# EAGLE design io-joint (EAGLE 4.16)
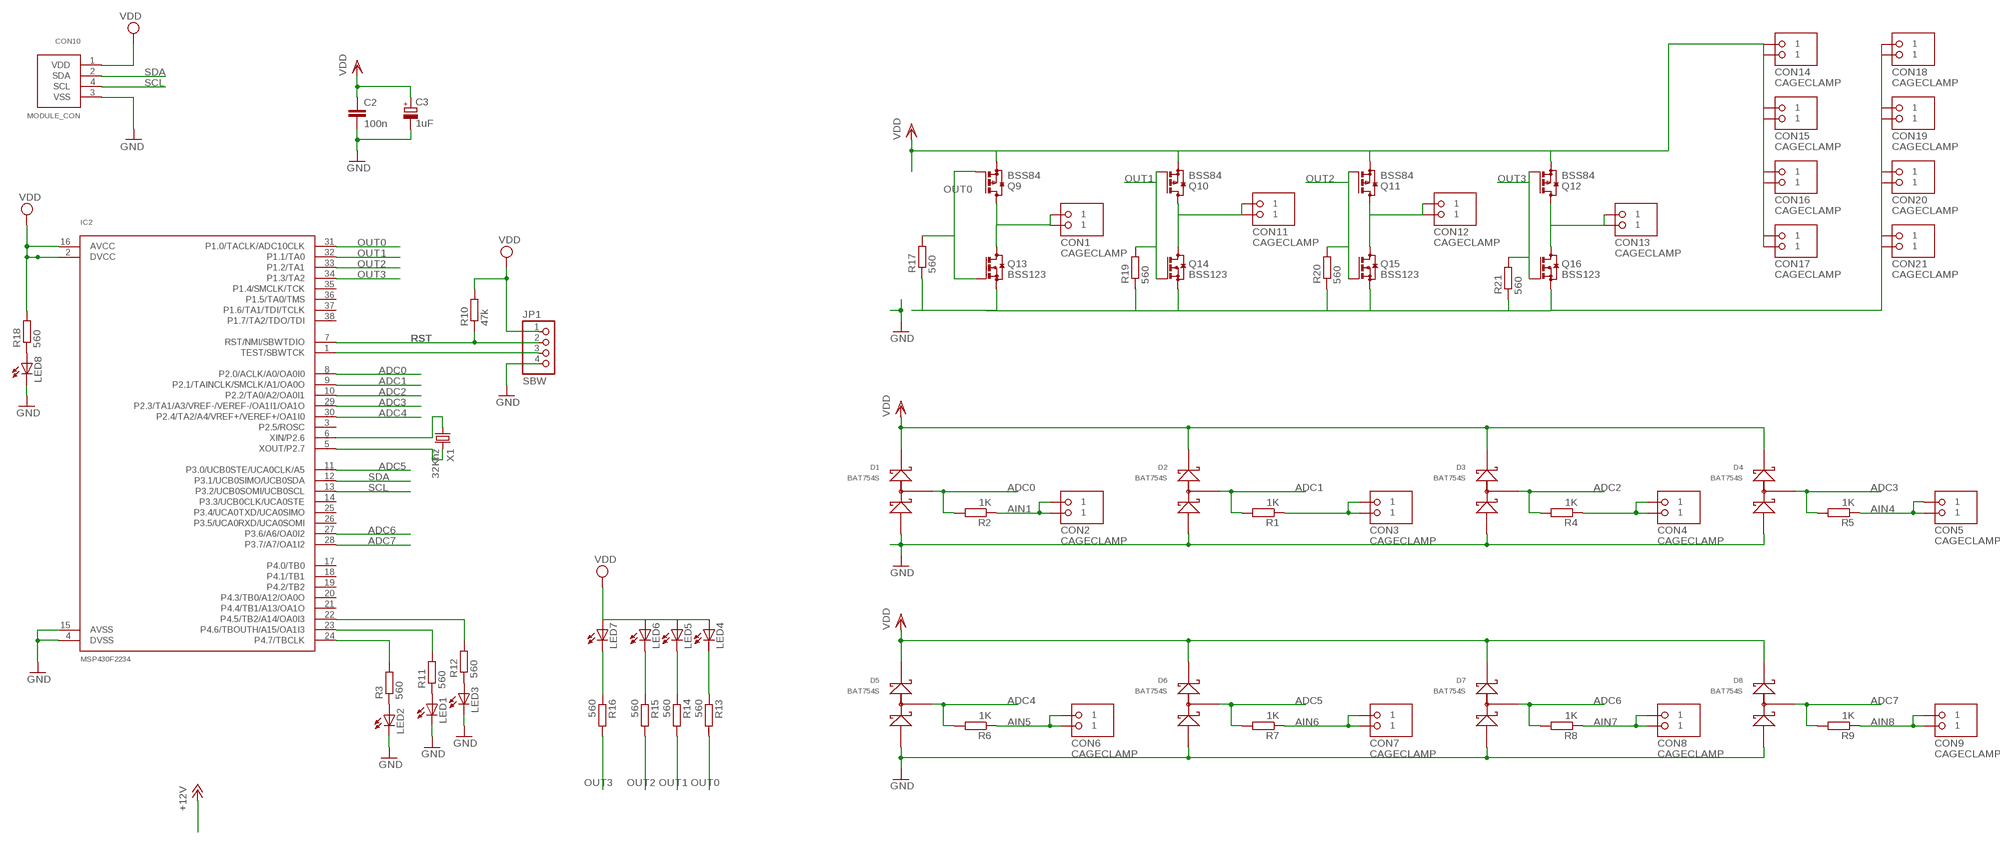
[diagram p0: schematic, sheet 1]

## Parts
C2  100n  C-EUC0603  [C0603]
C3  1uF  CPOL-EUB45181A  [B45181A]
CON1  CAGECLAMP  [CAGECLAMP]
CON2  CAGECLAMP  [CAGECLAMP]
CON3  CAGECLAMP  [CAGECLAMP]
CON4  CAGECLAMP  [CAGECLAMP]
CON5  CAGECLAMP  [CAGECLAMP]
CON6  CAGECLAMP  [CAGECLAMP]
CON7  CAGECLAMP  [CAGECLAMP]
CON8  CAGECLAMP  [CAGECLAMP]
CON9  CAGECLAMP  [CAGECLAMP]
CON10  MODULE_CON  [RJ11-4P4C]
CON11  CAGECLAMP  [CAGECLAMP]
CON12  CAGECLAMP  [CAGECLAMP]
CON13  CAGECLAMP  [CAGECLAMP]
CON14  CAGECLAMP  [CAGECLAMP]
CON15  CAGECLAMP  [CAGECLAMP]
CON16  CAGECLAMP  [CAGECLAMP]
CON17  CAGECLAMP  [CAGECLAMP]
CON18  CAGECLAMP  [CAGECLAMP]
CON19  CAGECLAMP  [CAGECLAMP]
CON20  CAGECLAMP  [CAGECLAMP]
CON21  CAGECLAMP  [CAGECLAMP]
D1  BAT754S  [SOT23]
D2  BAT754S  [SOT23]
D3  BAT754S  [SOT23]
D4  BAT754S  [SOT23]
D5  BAT754S  [SOT23]
D6  BAT754S  [SOT23]
D7  BAT754S  [SOT23]
D8  BAT754S  [SOT23]
IC2  MSP430F2234  [TSSOP38]
JP1  SBW  PINHD-1X4  [1X04]
LED1  LED3MM  [LED3MM]
LED2  LED3MM  [LED3MM]
LED3  LED3MM  [LED3MM]
LED4  LED3MM  [LED3MM]
LED5  LED3MM  [LED3MM]
LED6  LED3MM  [LED3MM]
LED7  LED3MM  [LED3MM]
LED8  LED3MM  [LED3MM]
Q9  BSS84  [SOT23]
Q10  BSS84  [SOT23]
Q11  BSS84  [SOT23]
Q12  BSS84  [SOT23]
Q13  BSS123  [SOT23]
Q14  BSS123  [SOT23]
Q15  BSS123  [SOT23]
Q16  BSS123  [SOT23]
R1  1K  R-EU_M1206  [M1206]
R2  1K  R-EU_M1206  [M1206]
R3  560  R-EU_M1206  [M1206]
R4  1K  R-EU_M1206  [M1206]
R5  1K  R-EU_M1206  [M1206]
R6  1K  R-EU_M1206  [M1206]
R7  1K  R-EU_M1206  [M1206]
R8  1K  R-EU_M1206  [M1206]
R9  1K  R-EU_M1206  [M1206]
R10  47k  R-EU_M1206  [M1206]
R11  560  R-EU_M1206  [M1206]
R12  560  R-EU_M1206  [M1206]
R13  560  R-EU_M1206  [M1206]
R14  560  R-EU_M1206  [M1206]
R15  560  R-EU_M1206  [M1206]
R16  560  R-EU_M1206  [M1206]
R17  560  R-EU_M1206  [M1206]
R18  560  R-EU_M1206  [M1206]
R19  560  R-EU_M1206  [M1206]
R20  560  R-EU_M1206  [M1206]
R21  560  R-EU_M1206  [M1206]
X1  32Khz  CRYSTALTC26H  [TC26H]

## Nets
ADC0: D1.3(MID) IC2.8(P2.0/ACLK/A0/OA0I0) R2.2
ADC1: D2.3(MID) IC2.9(P2.1/TAINCLK/SMCLK/A1/OA0O) R1.2
ADC2: D3.3(MID) IC2.10(P2.2/TA0/A2/OA0I1) R4.2
ADC3: D4.3(MID) IC2.29(P2.3/TA1/A3/VREF-/VEREF-/OA1I1/OA1O) R5.2
ADC4: D5.3(MID) IC2.30(P2.4/TA2/A4/VREF+/VEREF+/OA1I0) R6.2
ADC5: D6.3(MID) IC2.11(P3.0/UCB0STE/UCA0CLK/A5) R7.2
ADC6: D7.3(MID) IC2.27(P3.6/A6/OA0I2) R8.2
ADC7: D8.3(MID) IC2.28(P3.7/A7/OA1I2) R9.2
AIN1: CON2.1 CON2.2 R2.1
AIN4: CON5.1 CON5.2 R5.1
AIN5: CON6.1 CON6.2 R6.1
AIN6: CON7.1 CON7.2 R7.1
AIN7: CON8.1 CON8.2 R8.1
AIN8: CON9.1 CON9.2 R9.1
GND: C2.2 C3.- CON10.3(VSS) CON18.1 CON18.2 CON19.1 CON19.2 CON20.1 CON20.2 CON21.1 CON21.2 D1.1(ANODE) D2.1(ANODE) D3.1(ANODE) D4.1(ANODE) D5.1(ANODE) D6.1(ANODE) D7.1(ANODE) D8.1(ANODE) IC2.4(DVSS) IC2.15(AVSS) JP1.4 LED1.K(C) LED2.K(C) LED3.K(C) LED8.K(C) Q13.2(S) Q14.2(S) Q15.2(S) Q16.2(S) R17.1 R19.1 R20.1 R21.1
N$1: CON3.1 CON3.2 R1.1
N$2: CON11.1 CON11.2 Q10.3(D) Q14.3(D)
N$3: CON4.1 CON4.2 R4.1
N$4: IC2.6(XIN/P2.6) X1.1
N$5: IC2.24(P4.7/TBCLK) R3.2
N$6: LED2.A R3.1
N$7: CON1.1 CON1.2 Q9.3(D) Q13.3(D)
N$8: IC2.23(P4.6/TBOUTH/A15/OA1I3) R11.2
N$9: CON12.1 CON12.2 Q11.3(D) Q15.3(D)
N$10: IC2.1(TEST/SBWTCK) JP1.3
N$11: LED1.A R11.1
N$12: CON13.1 CON13.2 Q12.3(D) Q16.3(D)
N$13: IC2.22(P4.5/TB2/A14/OA0I3) R12.2
N$14: LED3.A R12.1
N$15: LED7.K(C) R16.1
N$16: LED6.K(C) R15.1
N$17: LED5.K(C) R14.1
N$18: LED4.K(C) R13.1
N$19: IC2.5(XOUT/P2.7) X1.2
N$20: LED8.A R18.1
OUT0: IC2.31(P1.0/TACLK/ADC10CLK) Q9.1(G) Q13.1(G) R13.2 R17.2
OUT1: IC2.32(P1.1/TA0) Q10.1(G) Q14.1(G) R14.2 R19.2
OUT2: IC2.33(P1.2/TA1) Q11.1(G) Q15.1(G) R15.2 R20.2
OUT3: IC2.34(P1.3/TA2) Q12.1(G) Q16.1(G) R16.2 R21.2
RST: IC2.7(RST/NMI/SBWTDIO) JP1.2 R10.1
SCL: CON10.4(SCL) IC2.13(P3.2/UCB0SOMI/UCB0SCL)
SDA: CON10.2(SDA) IC2.12(P3.1/UCB0SIMO/UCB0SDA)
VDD: C2.1 C3.+ CON10.1(VDD) CON14.1 CON14.2 CON15.1 CON15.2 CON16.1 CON16.2 CON17.1 CON17.2 D1.2(CATHODE) D2.2(CATHODE) D3.2(CATHODE) D4.2(CATHODE) D5.2(CATHODE) D6.2(CATHODE) D7.2(CATHODE) D8.2(CATHODE) IC2.2(DVCC) IC2.16(AVCC) JP1.1 LED4.A LED5.A LED6.A LED7.A Q9.2(S) Q10.2(S) Q11.2(S) Q12.2(S) R10.2 R18.2
Unconnected: IC2.3(P2.5/ROSC) IC2.14(P3.3/UCB0CLK/UCA0STE) IC2.17(P4.0/TB0) IC2.18(P4.1/TB1) IC2.19(P4.2/TB2) IC2.20(P4.3/TB0/A12/OA0O) IC2.21(P4.4/TB1/A13/OA1O) IC2.25(P3.4/UCA0TXD/UCA0SIMO) IC2.26(P3.5/UCA0RXD/UCA0SOMI) IC2.35(P1.4/SMCLK/TCK) IC2.36(P1.5/TA0/TMS) IC2.37(P1.6/TA1/TDI/TCLK) IC2.38(P1.7/TA2/TDO/TDI)

## Library data of the parts
C2 = rcl:C-EU: CAPACITOR, European symbol
C3 = rcl:CPOL-EU: POLARIZED CAPACITOR, European symbol
CON1-CON9 CON11-CON21 = ecssr:CAGECLAMP
CON10 = ecssr:MODULE_CON
D1-D8 = ecssr:BAT754S
IC2 = ecssr:MSP430F2234
JP1 = pinhead:PINHD-1X4: PIN HEADER
LED1-LED8 = led:LED: LED OSRAM: - CHIPLED LG R971, LG N971, LY N971, LG Q971, LY Q971, LO R971, LY R971 LH N974, LH R974 LS Q976, LO Q976, LY Q976 LO Q996 - Hyper CHIPLED LW Q18S LB Q993, LB Q99A, LB R99A - SideLED LS A670, LO A670, LY A670, LG A670, LP A670 LB A673, LV A673, LT A673, LW A673 LH A674 LY A675 LS A676, LA A676, LO A676, LY A676, LW A676 LS A679, LY A679, LG A679 - Hyper Micro SIDELED® LS Y876, LA Y876, LO Y876, LY Y876 LT Y87S - SmartLED LW L88C, LW L88S LB L89C, LB L89S, LG L890 LS L89K, LO L89K, LY L89K LS L896, LA L896, LO L896, LY L896 - TOPLED LS T670, LO T670, LY T670, LG T670, LP T670 LSG T670, LSP T670, LSY T670, LOP T670, LYG T670 LG T671, LOG T671, LSG T671 LB T673, LV T673, LT T673, LW T673 LH T674 LS T676, LA T676, LO T676, LY T676, LB T676, LH T676, LSB T676, LW T676 LB T67C, LV T67C, LT T67C, LS T67K, LO T67K, LY T67K, LW E67C LS E67B, LA E67B, LO E67B, LY E67B, LB E67C, LV E67C, LT E67C LW T67C LS T679, LY T679, LG T679 LS T770, LO T770, LY T770, LG T770, LP T770 LB T773, LV T773, LT T773, LW T773 LH T774 LS E675, LA E675, LY E675, LS T675 LS T776, LA T776, LO T776, LY T776, LB T776 LHGB T686 LT T68C, LB T68C - Hyper Mini TOPLED® LB M676 - Mini TOPLED Santana® LG M470 LS M47K, LO M47K, LY M47K Source: http://www.osram.convergy.de - LUMILED® LXK2-PW12-R00, LXK2-PW12-S00, LXK2-PW14-U00, LXK2-PW14-V00 LXK2-PM12-R00, LXK2-PM12-S00, LXK2-PM14-U00 LXK2-PE12-Q00, LXK2-PE12-R00, LXK2-PE12-S00, LXK2-PE14-T00, LXK2-PE14-U00 LXK2-PB12-K00, LXK2-PB12-L00, LXK2-PB12-M00, LXK2-PB14-N00, LXK2-PB14-P00, LXK2-PB14-Q00 LXK2-PR12-L00, LXK2-PR12-M00, LXK2-PR14-Q00, LXK2-PR14-R00 LXK2-PD12-Q00, LXK2-PD12-R00, LXK2-PD12-S00 LXK2-PH12-R00, LXK2-PH12-S00 LXK2-PL12-P00, LXK2-PL12-Q00, LXK2-PL12-R00 Source: www.luxeon.com
Q9-Q12 = transistor-small-signal:BSS84: P-CHANNEL MOS FET
Q13-Q16 = transistor-small-signal:BSS123: N-CHANNEL MOS FET
R1-R21 = rcl:R-EU_: RESISTOR, European symbol
X1 = crystal:CRYSTAL: CRYSTAL

## Board
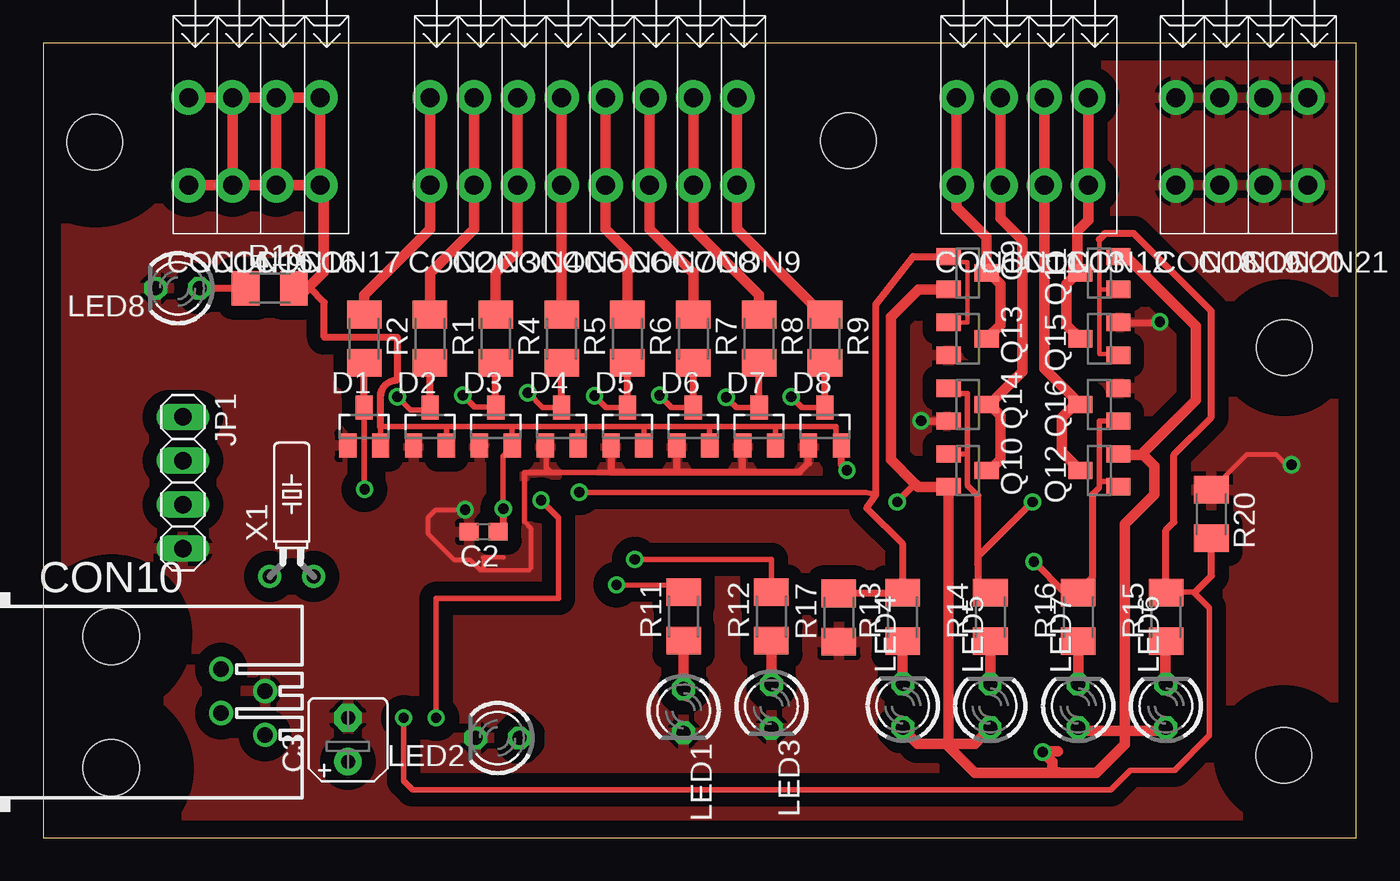
[diagram p1: board, top side]
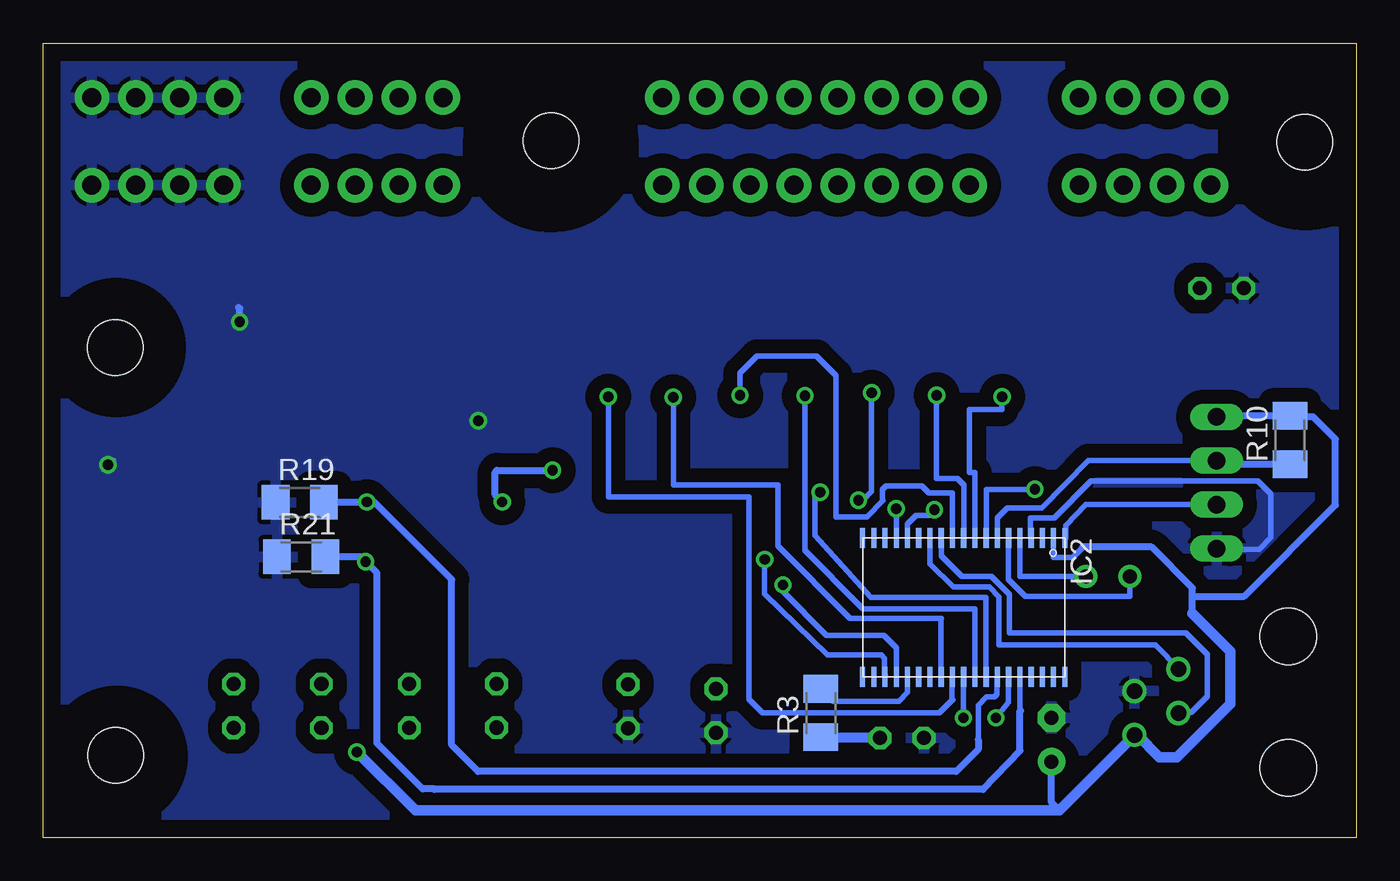
[diagram p2: board, bottom side, seen from below]

Size 76 x 46 mm. Coordinates in mm from the lower left corner, seen from the top.
Outline: 0,0 76,0 76,46 0,46 0,0
Copper layers (1*16): Top 0.035mm / dielectric 1.5mm / Bottom 0.035mm
Design rules "default": minimum track width 0.2mm, minimum drill 0.6mm, track to track 0.2mm, track to pad 0.2mm, pad to pad 0.2mm, via to via 0.2mm, smd to smd 0mil, copper to edge 40mil, drill to drill 8mil, minimum pad ring 10mil, minimum via ring 8mil, stop-mask expansion 4mil, vias tented up to drill 0mil, thermal gap 10mil
Holes 3.2 mm at 71.84,28.38 71.79,4.78 2.98,40.27 46.62,40.37
tRestrict: area -1,36.3 to 7,44.3; area 42.7,36.2 to 50.7,44.2; area 68.8,25.4 to 74.9,31.4; area 68.7,1.7 to 74.9,7.9; area 0.2,8 to 7.7,15.5; area 0.1,0.2 to 7.8,7.8
bRestrict: area -1.2,36.1 to 7.1,44.4; area 42.5,36 to 50.7,44.3; area 68.7,25.3 to 74.9,31.5; area 68.6,1.6 to 74.9,7.9

### Footprints (pad centres in the part's own frame; a part is rotated, then mirrored left to right if it is on the bottom)
C0603 = smd 1.1 x 1: 1 -0.85,0; 2 0.85,0
B45181A = drill 0.813 pad 1.6 round: + -1.27,0 | drill 0.813 pad 1.6 octagon: - 1.27,0
CAGECLAMP = drill 1.1 pad 2 round: 1 0,-0.01; 2 0,-5.08
RJ11-4P4C = drill 0.889 round: 1 1.905,8.89; 2 0.635,6.35; 3 -0.635,8.89; 4 -1.905,6.35 | hole 3.251: -3.81,0; 3.81,0
SOT23 = smd 1 x 1.4: 1 -0.95,-1.1; 2 0.95,-1.1; 3 0,1.1
TSSOP38 = smd 1.15 x 0.3: 1 0,0; 2 0,-0.65; 3 0,-1.3; 4 0,-1.95; 5 0,-2.6; 6 0,-3.25; 7 0,-3.9; 8 0,-4.55; 9 0,-5.2; 10 0,-5.85; 11 0,-6.5; 12 0,-7.15; 13 0,-7.8; 14 0,-8.45; 15 0,-9.1; 16 0,-9.75; 17 0,-10.4; 18 0,-11.05; 19 0,-11.7; 20 8.05,-11.7; 21 8.05,-11.05; 22 8.05,-10.4; 23 8.05,-9.75; 24 8.05,-9.1; 25 8.05,-8.45; 26 8.05,-7.8; 27 8.05,-7.15; 28 8.05,-6.5; 29 8.05,-5.85; 30 8.05,-5.2; 31 8.05,-4.55; 32 8.05,-3.9; 33 8.05,-3.25; 34 8.05,-2.6; 35 8.05,-1.95; 36 8.05,-1.3; 37 8.05,-0.65; 38 8.05,0
1X04 = drill 1.016 long: 1 -3.81,0; 2 -1.27,0; 3 1.27,0; 4 3.81,0
LED3MM = drill 0.813 octagon: A -1.27,0; K 1.27,0
M1206 = smd 1.6 x 2: 1 -1.4,0; 2 1.4,0
TC26H = drill 0.813 round: 1 -1.27,0; 2 1.27,0

### Placement (x,y rotation side)
C2  25.49,17.71 180 top
C3  17.64,5.67 90 top
CON1  52.87,42.86 0 top
CON2  22.39,42.86 0 top
CON3  24.93,42.86 0 top
CON4  27.47,42.86 0 top
CON5  30.01,42.86 0 top
CON6  32.55,42.86 0 top
CON7  35.09,42.86 0 top
CON8  37.63,42.86 0 top
CON9  40.17,42.86 0 top
CON10  3.95,7.86 270 top
CON11  55.41,42.86 0 top
CON12  60.49,42.86 0 top
CON13  57.95,42.86 0 top
CON14  8.42,42.86 0 top
CON15  10.96,42.86 0 top
CON16  13.5,42.86 0 top
CON17  16.04,42.86 0 top
CON18  65.57,42.86 0 top
CON19  68.11,42.86 0 top
CON20  70.65,42.86 0 top
CON21  73.19,42.86 0 top
D1  18.58,23.81 0 top
D2  22.39,23.81 0 top
D3  26.2,23.81 0 top
D4  30.01,23.81 0 top
D5  33.82,23.81 0 top
D6  37.63,23.81 0 top
D7  41.44,23.81 0 top
D8  45.25,23.81 0 top
IC2  16.88,17.36 270 bottom
JP1  8.09,20.56 270 top
LED1  37.07,7.35 270 top
LED2  26.3,5.78 180 top
LED3  42.15,7.6 270 top
LED4  49.75,7.65 90 top
LED5  54.81,7.63 90 top
LED6  64.98,7.63 90 top
LED7  59.9,7.63 90 top
LED8  7.78,31.81 180 top
Q9  53.5,32.7 270 top
Q10  53.5,21.27 270 top
Q11  61.12,32.7 90 top
Q12  61.12,21.27 90 top
Q13  53.5,28.89 270 top
Q14  53.5,25.08 270 top
Q15  61.12,28.89 90 top
Q16  61.12,25.08 90 top
R1  22.39,28.89 270 top
R2  18.58,28.89 270 top
R3  31,7.22 90 bottom
R4  26.2,28.89 270 top
R5  30.01,28.89 270 top
R6  33.82,28.89 270 top
R7  37.63,28.89 270 top
R8  41.44,28.89 270 top
R9  45.25,28.89 270 top
R10  3.84,23.02 90 bottom
R11  37.07,12.81 90 top
R12  42.15,12.81 90 top
R13  49.74,12.79 90 top
R14  54.82,12.79 90 top
R15  64.98,12.79 90 top
R16  59.9,12.79 90 top
R17  46.05,12.75 90 top
R18  13.12,31.81 0 top
R19  61.15,19.42 0 bottom
R20  67.61,18.74 270 top
R21  61.07,16.27 0 bottom
X1  14.39,15.12 0 top

### Tracks (layer width: path | path; a pad name or v marks a point on that pad's centre or on a via)
ADC0  (via drill 0.6)
  Top 0.305: D1.3 18.58,20.2 v18.6,20.18
  Top 0.406: 18.6,27.49 | 18.6,27.49 R2.2 | D1.3 18.58,27.47 18.6,27.49
  Bottom 0.305: IC2.8 21.4,17.36 21.4,20.18 v18.6,20.18
ADC1  (via drill 0.6)
  Top 0.305: D2.3 22.36,24.88 22.36,24.77 21.27,24.77 v20.51,25.54
  Top 0.406: R1.2 22.39,27.44 22.41,27.42 22.39,27.39 D2.3
  Bottom 0.305: IC2.9 22.08,17.36 22.08,21.14 22.39,21.14 22.39,24.8 20.51,24.8 v20.51,25.54
ADC2  (via drill 0.6)
  Top 0.305: 26.21,24.93 26.22,24.93 | 26.21,24.93 D3.3 | v24.29,25.61 24.98,24.93 26.21,24.93
  Top 0.406: D3.3 26.2,25.13 26.22,25.16 26.2,25.18 R4.2
  Bottom 0.305: IC2.10 22.73,20.43 23.09,20.8 24.29,20.8 v24.29,25.61
ADC3  (via drill 0.6)
  Top 0.305: D4.3 28.91,24.91 v28.05,25.77 | v28.81,19.54 29.83,18.53 29.83,13.85 22.74,13.85 v22.74,6.94
  Top 0.406: R5.2 30.01,27.44 29.96,27.39 30.01,27.34 D4.3
  Bottom 0.305: v28.05,25.77 28.05,20.05 28.56,19.54 v28.81,19.54 | 22.73,9.36 22.72,9.36 | 22.73,9.36 IC2.29 22.73,9.26 22.74,9.26 v22.74,6.94 | 22.73,9.36 22.74,9.36
ADC4  (via drill 0.6)
  Top 0.305: D5.3 32.59,24.91 v31.91,25.59
  Top 0.406: 33.74,27.49 | 33.74,27.49 R6.2 | D5.3 33.82,27.42 33.74,27.49
  Bottom 0.305: 22.07,9.33 22.06,9.33 | 22.07,9.33 IC2.30 22.07,9.36 | 22.07,9.33 22.08,9.33 | 22.07,9.36 22.06,9.36 | 22.07,9.36 22.08,9.36 22.08,13.26 28.56,13.26 28.73,13.43 28.72,13.43 31.92,16.63 31.92,16.98 v31.91,25.59
ADC5  (via drill 0.6)
  Top 0.305: D6.3 36.37,24.91 v35.67,25.61
  Top 0.406: 37.63,27.59 R7.2 D6.3
  Bottom 0.305: v35.67,25.61 35.67,26.91 34.68,27.9 31.25,27.9 30.11,26.76 30.11,18.58 28.33,18.58 27.39,19.52 27.39,19.54 27.42,19.57 27.42,20.18 27.24,20.36 25.13,20.36 24.75,19.97 23.38,19.97 IC2.11
ADC6  (via drill 0.6)
  Top 0.305: D7.3 40.13,24.91 v39.53,25.51
  Top 0.406: 41.44,27.52 R8.2 D7.3
  Bottom 0.305: v39.53,25.51 39.53,20.43 33.49,20.43 33.49,16.93 33.48,16.92 33.48,16.89 29.3,12.71 24.01,12.71 24.04,12.68 24.04,9.32 IC2.27
ADC7  (via drill 0.6)
  Top 0.305: D8.3 43.92,24.91 v43.29,25.54
  Top 0.406: D8.3 R9.2
  Bottom 0.305: v43.29,25.54 43.29,19.72 35.14,19.72 35.14,18.5 35.16,17.56 35.16,8.01 34.38,7.22 24.14,7.22 23.38,7.99 | IC2.28 23.38,9.28 23.4,9.28 23.4,8.01 23.38,7.99 | 23.38,7.99 23.35,7.99
AIN1
  Top 0.61: CON2.1 CON2.2 22.39,35.24 18.58,31.43 R2.1 18.58,30.16
AIN4
  Top 0.61: CON5.1 CON5.2 R5.1 30.01,30.16
AIN5
  Top 0.61: CON6.1 CON6.2 32.55,35.24 33.82,33.97 R6.1 33.82,30.16
AIN6
  Top 0.61: 37.63,30.16 R7.1 37.63,32.7 35.09,35.24 CON7.2 35.09,42.88 | 35.09,42.88 CON7.1 | 35.09,42.88 35.06,42.91
AIN7
  Top 0.61: CON8.1 CON8.2 37.63,35.24 41.44,31.43 R8.1 41.44,30.16
AIN8
  Top 0.61: CON9.1 CON9.2 40.17,35.24 45.25,30.16 R9.1
GND  (via drill 0.6)
  Top 0.254: 26.64,16.24 25.47,16.24 25.48,16.23 25.48,15.66 25.31,15.49 | 27.85,18.32 28.25,17.92 28.25,15.61 28.13,15.49 25.31,15.49 | 25.31,15.49 24.71,16.09 23.77,16.09 22.27,17.59 22.27,18.55 22.71,18.99 v24.42,18.99 v24.42,18.98 | R20.1 69.65,22.18 71.36,22.18 71.95,21.59 v72.26,21.59
  Top 0.305: D5.1 32.87,21.14 29.37,21.14 | D4.1 29.09,22.72 29.09,21.42 29.37,21.14 | 29.37,21.14 27.85,21.14 27.85,18.32 | 25.26,22.74 D3.1 25.25,22.69 25.24,22.68 25.52,22.4
  Top 0.406: Q15.2 64.59,29.84 v64.63,29.88 | Q14.2 v50.82,24.13 v50.81,24.14 | D8.1 44.3,21.69 43.77,21.17 40.5,21.17 | 36.71,21.17 32.85,21.17 32.87,21.18 D5.1 | 36.71,21.17 40.5,21.17 | D7.1 40.49,21.18 40.5,21.17 | D6.1 36.68,21.2 36.71,21.17
  Bottom 0.254: v72.26,21.59 71.97,21.88 71.89,21.88
  Bottom 0.305: IC2.4 18.86,17.39 18.86,18.53 17.48,18.53 15.35,20.66 5.7,20.66 4.94,19.9 4.94,17.38 5.62,16.7 8.01,16.7 8.06,16.75 JP1.4 | IC2.15 25.98,18.16 25.49,18.65 24.75,18.65 v24.42,18.98
  Bottom 0.406: v64.63,29.88 64.63,30.64 64.7,30.72 | v50.81,24.14 50.81,24.22 50.84,24.24
  pour Top (isolate 0.813): -3,48 -3,-2 77,-2 77,48
  pour Bottom (isolate 0.813): -2,50 -2,-1 79,-1 79,50
N$1
  Top 0.61: CON3.1 CON3.2 24.93,35.24 22.39,32.7 R1.1 22.39,30.16
N$2
  Top 0.61: 54.77,25.08 55.41,24.44 55.41,21.9 54.77,21.27 Q10.3 | 54.77,25.08 Q14.3 | 54.77,25.08 56.68,26.98 56.68,34.6 55.41,35.87 CON11.2 CON11.1
N$3
  Top 0.61: CON4.1 CON4.2 27.47,33.97 26.2,32.7 R4.1 26.2,30.16
N$4
  Bottom 0.305: X1.1 13.12,13.98 19.16,13.98 20.13,14.95 IC2.6
N$5
  Bottom 0.305: R3.2 30.28,7.91 26.48,7.91 25.97,8.42 25.97,9.3 IC2.24
N$6
  Bottom 0.61: LED2.A R3.1
N$7
  Top 0.61: Q13.3 55.41,29.69 55.41,32.06 54.77,32.7 Q9.3 54.6,34.77 52.87,36.51 CON1.2 CON1.1
N$8  (via drill 0.6)
  Top 0.305: R11.2 37.07,14.61 v33.18,14.64
  Bottom 0.305: v33.18,14.64 33.21,14.28 30.67,11.72 27.34,11.72 26.6,10.98 26.6,9.31 26.61,9.31 IC2.23
N$9
  Top 0.61: Q15.3 59.22,29.69 59.22,32.06 59.85,32.7 | 59.85,32.7 Q11.3 | 59.85,32.7 59.85,35.11 60.49,35.75 CON12.2 CON12.1
N$10
  Bottom 0.305: JP1.3 15.66,19.29 16.82,18.07 16.82,17.36 16.88,17.31 IC2.1
N$11
  Top 0.61: LED1.A R11.1
N$12
  Top 0.61: Q12.3 58.96,22.33 58.96,24.32 59.73,25.08 Q16.3 | Q16.3 60.11,25.08 | Q16.3 57.95,27.15 CON13.2 CON13.1
N$13  (via drill 0.6)
  Top 0.305: R12.2 42.15,16.11 v34.25,16.11
  Bottom 0.305: v34.25,16.11 34.25,14.13 30.62,10.58 27.49,10.58 27.31,10.4 27.31,9.43 27.26,9.38 27.27,9.37 IC2.22
N$14
  Top 0.61: LED3.A R12.1
N$15
  Top 0.61: R16.1 LED7.K
N$16
  Top 0.61: LED6.K 64.96,8.91 64.96,11.36 R15.1
N$17
  Top 0.61: R14.1 54.83,11.38 54.83,8.92 LED5.K
N$18
  Top 0.61: R13.1 | R13.1 | LED4.K R13.1
N$19
  Bottom 0.305: IC2.5 19.48,15.12 X1.2
N$20
  Top 0.406: LED8.A 9.05,31.84 11.69,31.84 R18.1
OUT0  (via drill 0.6)
  Top 0.254: Q13.1 53.5,29.84 53.5,33.33 52.87,33.33
  Top 0.305: v31.02,20 47.61,20 48.19,19.87 | 52.39,33.66 52.38,33.66 | Q9.1 52.39,33.66 | 52.87,33.33 52.54,33.66 52.39,33.66
  Top 0.406: Q9.1 50.36,33.65 48.19,30.87 48.19,19.87 47.66,19.09 49.72,17.03 49.72,14.13 49.74,14.11 | 49.74,14.11 49.77,14.08 | 49.74,14.11 R13.2 49.71,14.15 R17.2
  Bottom 0.305: IC2.31 21.45,9.33 21.45,13.93 28.07,13.93 28.08,13.93 31.33,17.51 31.33,19.69 v31.02,20
OUT1  (via drill 0.6)
  Top 0.305: 53.5,22.22 Q10.1 | 53.5,22.22 53.5,25.71 52.23,25.71 52.23,26.03 Q14.1 | 53.5,22.22 53.5,20.41 54.11,19.8
  Top 0.406: R14.2 54.82,14.23 54.11,14.95 54.11,15.76 | 54.11,15.76 54.11,19.8 | 54.11,15.76 54.11,16.29 v57.26,19.44
  Bottom 0.305: 21.88,5.67 21.88,7.68 21.4,8.16 20.94,8.16 20.81,8.29 20.81,9.31 IC2.32
  Bottom 0.406: 21.88,5.67 21.88,5.12 23.15,3.85 50.84,3.85 52.36,5.37 52.36,14.95 56.85,19.44 v57.26,19.44 57.26,19.49 57.28,19.51 57.37,19.42 R19.2
OUT2  (via drill 0.6)
  Top 0.254: Q11.1 61.12,31.75 61.12,28 | Q15.1 62.27,27.94 62.27,28 61.12,28 | 61.12,34.63 61.12,28 | R15.2 64.98,14.13 65.01,14.11
  Top 0.305: 64.91,14.23 66.58,14.23 66.63,14.18 67.5,13.32 67.5,5.93 65.49,3.92 62.92,3.92 61.78,2.78 21.37,2.78 20.86,3.29 v20.86,6.94
  Top 0.406: R15.2 64.95,14.19 64.91,14.23 64.98,14.31 64.98,17.82 65.44,18.27 65.44,22.18 67.6,24.34 67.6,29.95 | 67.6,29.95 67.6,29.98 | 61.45,34.98 61.43,34.98 | 61.12,34.63 61.45,34.96 61.45,34.98 | 61.45,34.98 63.12,34.98 67.6,30.5 67.6,29.95 | R20.2 67.61,15.16 66.63,14.18
  Bottom 0.305: IC2.33 20.13,7.83 v20.86,6.94
OUT3  (via drill 0.6)
  Top 0.305: Q16.1 61.12,24.13 61.12,20.63 | Q12.1 62.39,20.32 62.39,20.63 61.12,20.63 | 61.12,20.63 61.12,20.28 60.74,19.9
  Top 0.406: 59.85,14.21 59.87,14.19 R16.2 | 60.74,19.9 60.74,15.1 59.85,14.21 | 59.85,14.21 59.12,14.21 v57.34,15.99
  Bottom 0.305: 19.47,7.35 19.39,7.35 19.48,7.43 IC2.34
  Bottom 0.406: 19.44,7.38 19.47,7.35 19.47,5.04 21.6,2.8 53.35,2.8 53.35,2.83 54.03,2.83 56.68,5.47 56.68,15.33 v57.34,15.99 57.29,15.99 | 57.29,15.99 57.28,15.98 | R21.2 57.57,16.27 57.29,15.99
RST
  Bottom 0.305: JP1.2 15.5,21.83 18.2,19.09 20.2,19.09 20.76,18.53 20.76,17.33 20.77,17.35 IC2.7
  Bottom 0.406: JP1.2 8.09,21.85 8.04,21.9 7.75,21.62 R10.1
SCL
  Bottom 0.305: IC2.13 24.68,15.86 23.33,14.51 21.24,14.51 20.68,13.95 20.68,11.16 11.64,11.16 10.25,9.76 CON10.4
SDA
  Bottom 0.305: IC2.12 24.02,16.33 22.82,15.12 21.12,15.12 20.07,14.08 20.07,11.87 9.87,11.87 8.62,10.63 8.62,8.19 9.53,7.27 10.3,7.27 CON10.2
VDD  (via drill 0.6)
  Top 0.305: D1.2 19.53,23.81 23.02,23.81 | 27.47,23.81 23.02,23.81 | 30.64,23.81 27.47,23.81 | 34.45,23.81 30.64,23.81 | 38.26,23.81 34.45,23.81 | 42.07,23.81 38.26,23.81 | 42.07,23.81 45.88,23.81 45.88,22.54 46.2,22.54 D8.2 | D2.2 23.34,23.81 23.02,23.81 | 27.47,23.81 27.15,23.81 D3.2 27.15,22.63 27.16,22.61 26.63,22.08 v26.63,19.06 | D4.2 30.96,23.81 30.64,23.81 | D6.2 38.58,23.81 38.26,23.81 | D5.2 34.77,23.81 34.45,23.81 | D7.2 42.39,23.81 42.07,23.81
  Top 0.406: 19.53,23.81 19.53,25.52 arc-90 20.51,26.5 20.51,28.96 16.27,28.96 16.27,31 15.45,31.81 R18.2 | R18.2 14.44,31.81 14.41,31.79 | 46.2,22.54 46.2,21.59 v46.52,21.27 | 50.51,20.53 50.47,20.49 49.44,19.47 v49.44,19.44 | C2.1 26.63,18.01 v26.63,19.06 | 14.57,31.81 14.57,31.85 | R18.2 14.57,31.81 | 14.97,31.48 14.57,31.48 14.57,31.81
  Top 0.61: Q9.2 50.65,31.75 49.06,30.16 49.06,21.9 50.47,20.49 50.64,20.32 Q10.2 52.4,5.44 | 62.39,22.16 63.66,22.16 64.3,21.52 64.3,19.87 62.59,18.17 62.59,6.18 | 62.39,22.16 62.27,22.16 62.22,22.2 Q12.2 62.33,22.22 62.39,22.16 | 62.39,22.16 63.53,22.16 66.71,25.33 66.71,29.63 62.75,33.59 62.24,33.59 62.24,33.63 Q11.2 62.22,33.56 | CON16.1 16.03,42.85 CON17.1 | CON16.1 CON15.1 | CON15.1 CON14.1 | CON15.2 CON14.2 | CON16.2 CON15.2 | CON17.2 CON16.2 | CON17.1 | CON17.2 CON17.1 | CON16.1 | CON16.2 CON16.1 | CON15.1 | CON15.2 CON15.1 | 14.77,31.43 14.52,31.68 R18.2 | 52.4,5.44 52.4,5.3 53.93,3.77 58.4,3.77 | 58.4,3.77 58.76,3.77 | 58.76,3.77 60.94,3.77 62.59,5.42 62.59,6.18 | 58.76,3.77 58.76,3.79 | 58.4,3.77 58.4,4.4 v57.84,4.96 v57.85,4.97 57.85,5 58.72,5 | CON17.2 16.24,37.78 16.24,32.75 14.97,31.48 | 62.59,6.18 62.58,6.18 | 62.58,6.18 | 52.4,5.44 50.61,5.44 49.72,6.33 49.72,6.38 LED4.A | LED5.A 54.83,6.36 54.84,6.35 53.93,5.44 52.4,5.44 | LED6.A 64.81,6.18 62.58,6.18 | 59.9,6.39 59.89,6.4 | 59.9,6.39 LED7.A | 62.58,6.18 60.11,6.18 59.9,6.39
  Bottom 0.305: IC2.16 v26.62,19.06 v26.63,19.06 | IC2.2 17.52,16.24 16.39,16.24 15.81,16.82 | 9.56,13.01 9.51,13.01 9.48,12.99
  Bottom 0.406: 8.14,24.42 JP1.1 | 8.14,24.42 R10.2 3.79,24.37 2.5,24.37 1.2,23.07 1.2,19.26 6.49,13.98 9.48,13.98 | 8.14,24.42 8.21,24.5 | v46.52,21.27 49.74,21.27 49.84,21.17 49.84,19.85 v49.44,19.44 | 9.48,12.99 9.48,13.98 | 9.48,13.98 9.48,14.46 11.85,16.82 15.81,16.82 15.83,16.82 | 17.64,4.5 C3.+ 17.64,2.04 17.18,1.58
  Bottom 0.61: 9.48,12.99 7.3,10.8 7.3,7.76 10.4,4.66 11.39,4.66 12.68,5.95 CON10.1 12.84,5.93 17.18,1.58 54.44,1.58 57.82,4.96 v57.84,4.96